# Altium schematic sheet 03_RPiCM4.SchDoc: Raspberry Pi Compute Module 4
size A2; Organization: Greenfield Tech Solutions; Address1: Molendreef 33; Address2: Ossendrecht; Address3: 4641CS; Address4: The Netherlands; SheetNumber: 3; SheetTotal: 11
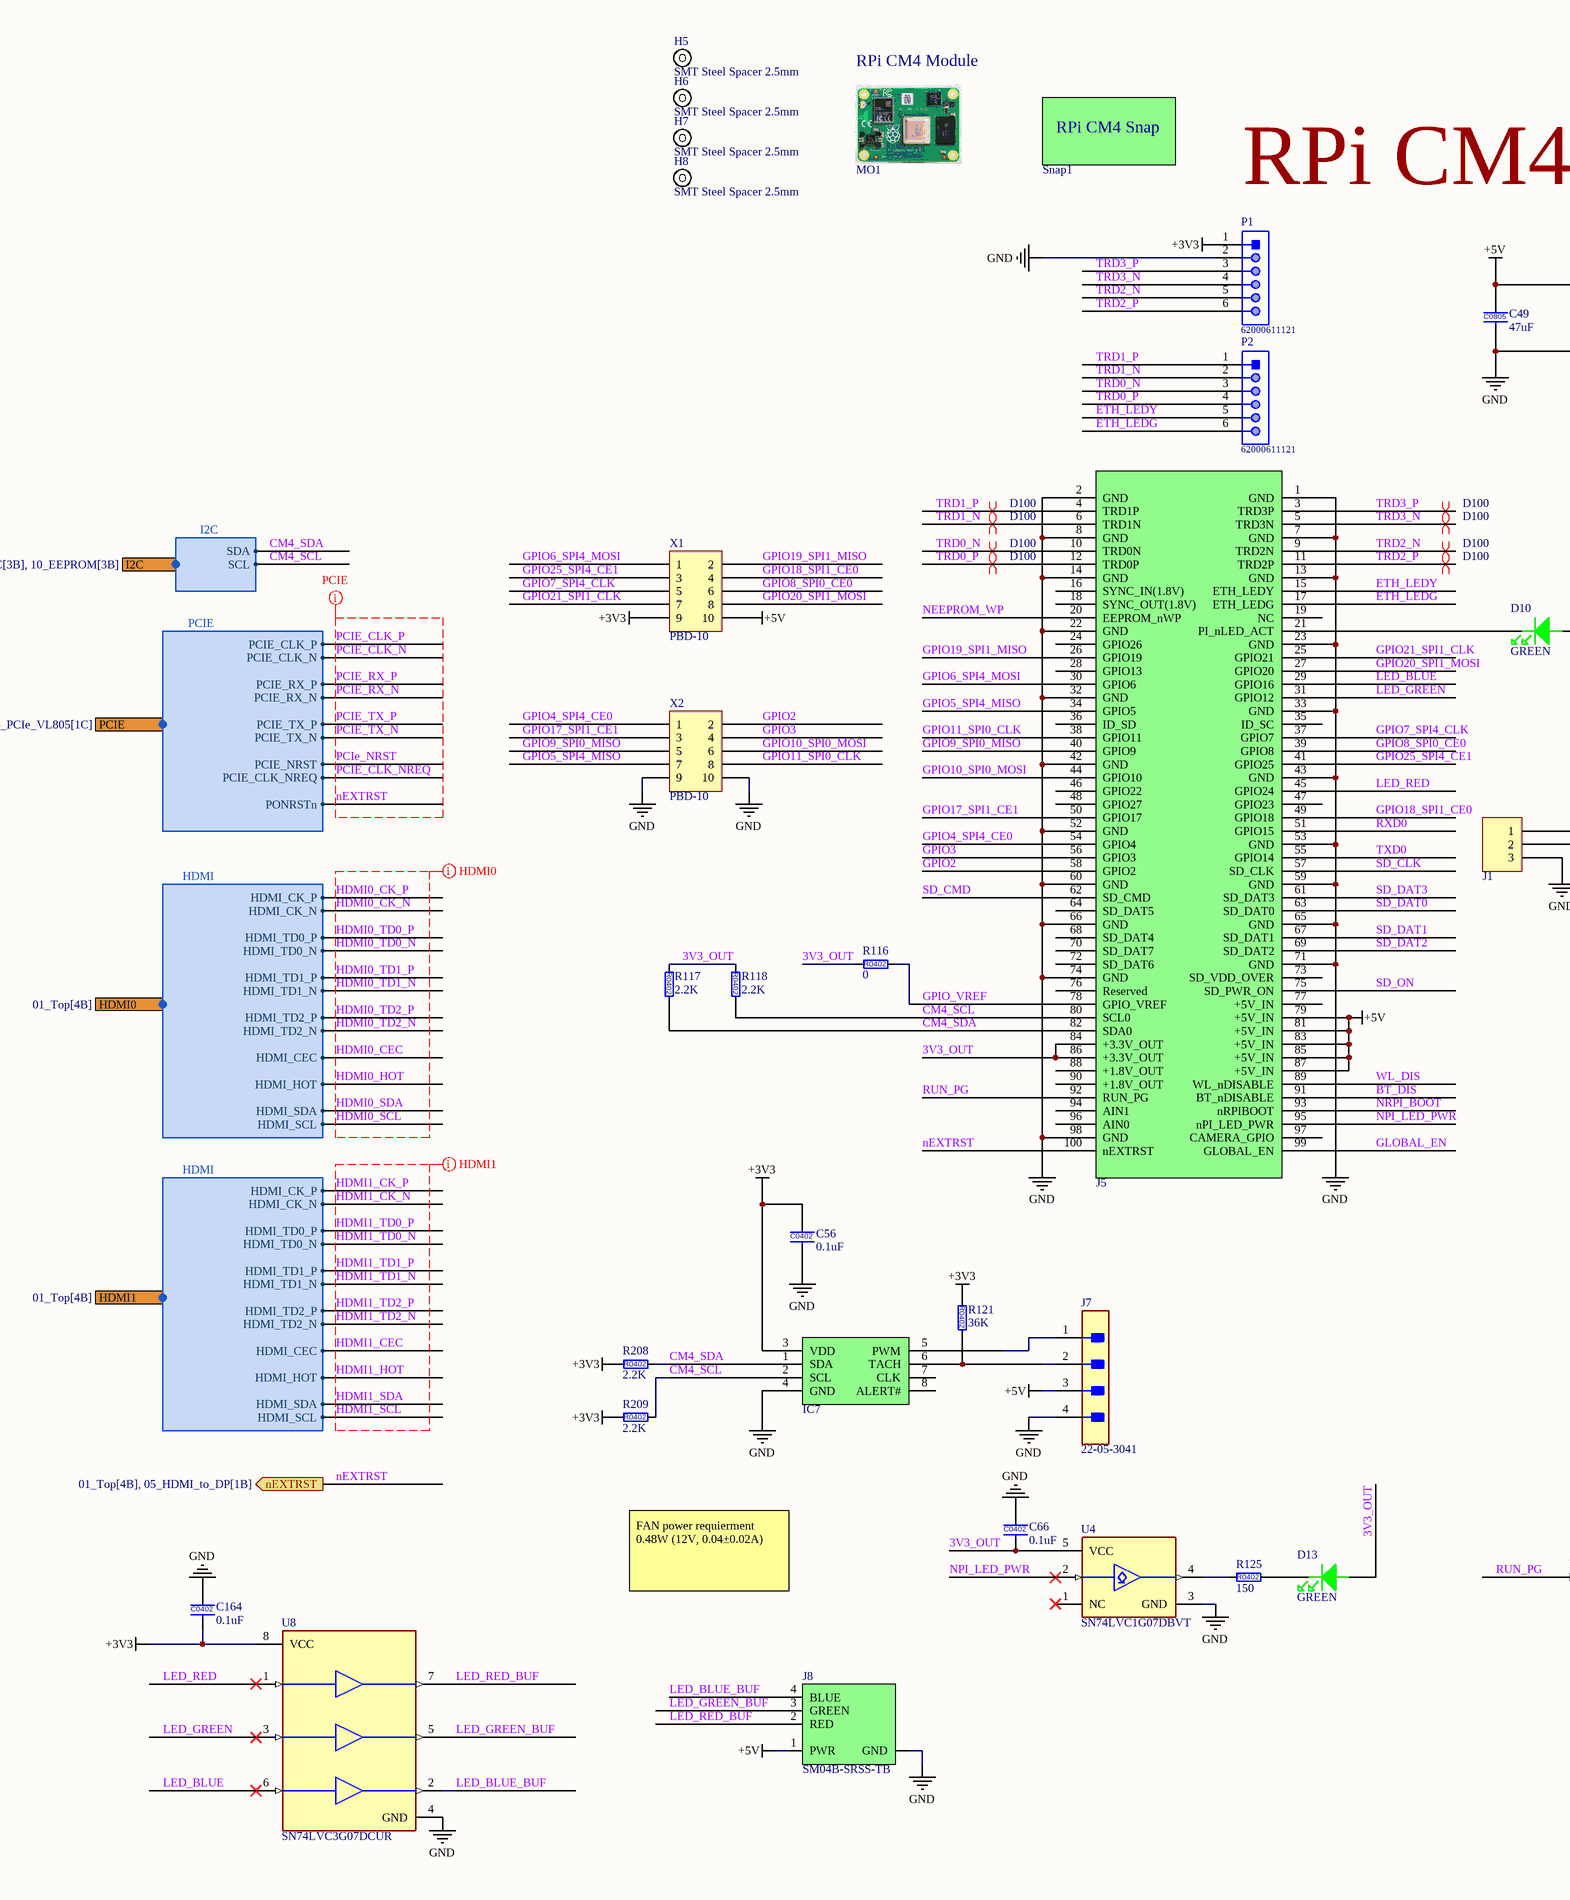
[diagram p0: 03_RPiCM4.SchDoc, left]
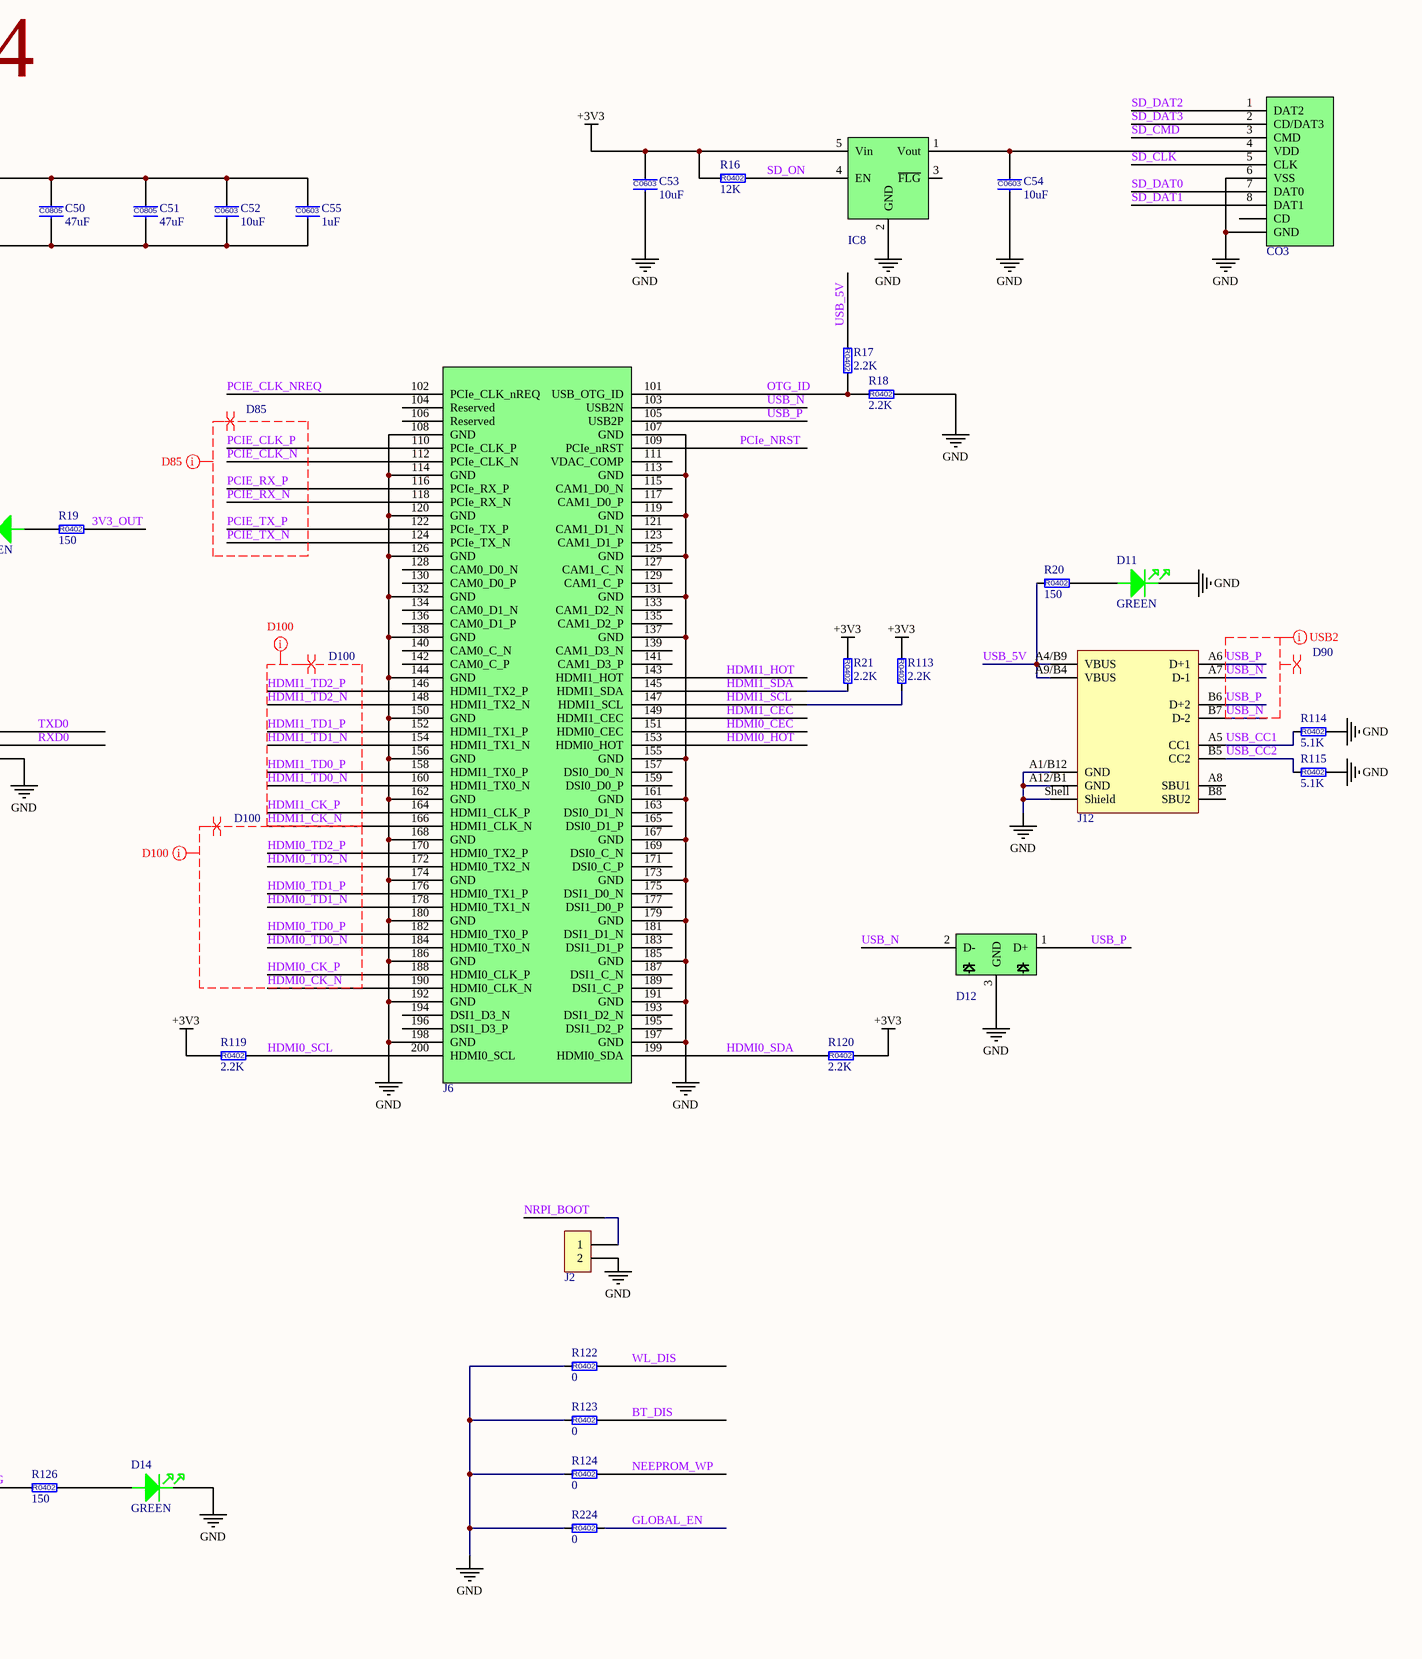
[diagram p1: 03_RPiCM4.SchDoc, right]

## Parts
C49  47uF  [C0805]
C50  47uF  [C0805]
C51  47uF  [C0805]
C52  10uF  [C0603]
C53  10uF  [C0603]
C54  10uF  [C0603]
C55  1uF  [C0603]
C56  0.1uF  [C0402]
C66  0.1uF  [C0402]
C164  0.1uF  [C0402]
CO3  µSD-Card  [693071030811]  (value not drawn)
D10  GREEN  [LED_0603]
D11  GREEN  [LED_0603]
D12  TPD2EUSB30DRTR  [TPD2EUSB30DRTR_SOT-3]  (value not drawn)
D13  GREEN  [LED_0603]
D14  GREEN  [LED_0603]
H5  SMT Steel Spacer 2.5mm  (mechanical)
H6  SMT Steel Spacer 2.5mm  (mechanical)
H7  SMT Steel Spacer 2.5mm  (mechanical)
H8  SMT Steel Spacer 2.5mm  (mechanical)
IC7  EMC2301  [EMC2301-1-ACZL-TR_MSOP-8]  (value not drawn)
IC8  RT9742  [RT9742GGJ5_SOT_23_5]  (value not drawn)
J1  PLS-3  [PLS-3-3D]  (value not drawn)
J2  PLS-2  [PLS-2-3D]  (value not drawn)
J5  CM4-1  [CM4_CON_A]  (value not drawn)
J6  CM4-1  [CM4_Con_B]  (value not drawn)
J7  22-05-3041  [FP-22-05-3041-MFG]
J8  SM04B-SRSS-TB  [SM04B]
J12  USB4105-GF-A  [USB4105-GF-A]  (value not drawn)
MO1  CM4_module  [CM4_step]  (value not drawn)  (no BOM)
P1  62000611121  [62000611121]
P2  62000611121  [62000611121]
R16  12K  [R0402]
R17  2.2K  [R0402]
R18  2.2K  [R0402]
R19  150  [R0402]
R20  150  [R0402]
R21  2.2K  [R0402]
R113  2.2K  [R0402]
R114  5.1K  [R0402]
R115  5.1K  [R0402]
R116  0  [R0402]
R117  2.2K  [R0402]
R118  2.2K  [R0402]
R119  2.2K  [R0402]
R120  2.2K  [R0402]
R121  36K  [R0402]
R122  0  [R0402]
R123  0  [R0402]
R124  0  [R0402]
R125  150  [R0402]
R126  150  [R0402]
R208  2.2K  [R0402]
R209  2.2K  [R0402]
R224  0  [R0402]
Snap1  CM4-1  [CM4_snap]  (value not drawn)  (no BOM)
U4  SN74LVC1G07DBVT  [SN74LVC1G07DBVT_SOT_23_5]
U8  SN74LVC3G07DCUR  [SN74LVC3G07DCUR_VSSOP_8]
X1  PBD-10  [PXD-10]
X2  PBD-10  [PXD-10]

## Ports
HDMI0 (harness HDMI, see 01_Top[4B]), HDMI1 (harness HDMI, see 01_Top[4B]), I2C (harness I2C, see 01_Top[4B], 05_HDMI_to_DP[1B], 06_USB_Type-C_DFP[1B], 07_USB_Type-C_DFP_DP_ALT[1B], 08_USB_Type-C_DFP_DP_ALT_buttom[1B], 09_RTC[3B], 10_EEPROM[3B]), nEXTRST (out, see 01_Top[4B], 05_HDMI_to_DP[1B]), PCIE (harness PCIE, see 01_Top[5B], 04_PCIe_VL805[1C])

## Harnesses
HDMI: HDMI_TD0_P, HDMI_TD1_P, HDMI_TD1_N, HDMI_TD0_N, HDMI_CK_N, HDMI_CK_P, HDMI_TD2_P, HDMI_TD2_N, HDMI_SDA, HDMI_SCL, HDMI_CEC, HDMI_HOT
I2C: SDA, SCL
PCIE: PCIE_CLK_NREQ, PCIE_CLK_P, PCIE_CLK_N, PCIE_NRST, PCIE_RX_P, PCIE_TX_P, PCIE_RX_N, PCIE_TX_N, PONRSTn

## Nets
+3V3: C53.1 C56.1 C164.2 IC7.3(VDD) IC8.5(Vin) P1.1 R16.1 R21.1 R113.1 R119.1 R120.2 R121.1 R208.1 R209.1 U8.8(VCC) X1.9
+5V: C49.1 C50.1 C51.1 C52.1 C55.1 J5.79(+5V_IN) J5.81(+5V_IN) J5.83(+5V_IN) J5.85(+5V_IN) J5.87(+5V_IN) J7.3 J8.1(PWR) X1.10
GND: C49.2 C50.2 C51.2 C52.2 C53.2 C54.2 C55.2 C56.2 C66.1 C164.1 CO3.6(VSS) CO3.GND D11.1(Cathode) D12.3(GND) D14.1(Cathode) IC7.4(GND) IC8.2(GND) J1.3 J2.2 J5.1(GND) J5.2(GND) J5.7(GND) J5.8(GND) J5.13(GND) J5.14(GND) J5.22(GND) J5.23(GND) J5.32(GND) J5.33(GND) J5.42(GND) J5.43(GND) J5.52(GND) J5.53(GND) J5.59(GND) J5.60(GND) J5.65(GND) J5.66(GND) J5.71(GND) J5.74(GND) J5.98(GND) J6.107(GND) J6.108(GND) J6.113(GND) J6.114(GND) J6.119(GND) J6.120(GND) J6.125(GND) J6.126(GND) J6.131(GND) J6.132(GND) J6.137(GND) J6.138(GND) J6.144(GND) J6.150(GND) J6.155(GND) J6.156(GND) J6.161(GND) J6.162(GND) J6.167(GND) J6.168(GND) J6.173(GND) J6.174(GND) J6.179(GND) J6.180(GND) J6.185(GND) J6.186(GND) J6.191(GND) J6.192(GND) J6.197(GND) J6.198(GND) J7.4 J8.5(GND) J12.A1/B12(GND) J12.A12/B1(GND) J12.Shell(Shield) P1.2 R18.2 R114.2 R115.2 R122.1 R123.1 R124.1 R224.1 U4.3(GND) U8.4(GND) X2.9 X2.10
3V3_OUT: C66.2 D13.2(Anode) J5.84(+3.3V_OUT) J5.86(+3.3V_OUT) R19.2 R116.1 R117.1 R118.1 U4.5(VCC)
BT_DIS: J5.91(BT_nDISABLE) R123.2
CM4_SCL: IC7.2(SCL) J5.80(SCL0) R118.2 R209.2 ; port I2C.SCL
CM4_SDA: IC7.1(SDA) J5.82(SDA0) R117.2 R208.2 ; port I2C.SDA
ETH_LEDG: J5.17(ETH_LEDG) P2.6
ETH_LEDY: J5.15(ETH_LEDY) P2.5
GLOBAL_EN: J5.99(GLOBAL_EN) R224.2
GPIO2: J5.58(GPIO2) X2.2
GPIO3: J5.56(GPIO3) X2.4
GPIO4_SPI4_CE0: J5.54(GPIO4) X2.1
GPIO5_SPI4_MISO: J5.34(GPIO5) X2.7
GPIO6_SPI4_MOSI: J5.30(GPIO6) X1.1
GPIO7_SPI4_CLK: J5.37(GPIO7) X1.5
GPIO8_SPI0_CE0: J5.39(GPIO8) X1.6
GPIO9_SPI0_MISO: J5.40(GPIO9) X2.5
GPIO10_SPI0_MOSI: J5.44(GPIO10) X2.6
GPIO11_SPI0_CLK: J5.38(GPIO11) X2.8
GPIO17_SPI1_CE1: J5.50(GPIO17) X2.3
GPIO18_SPI1_CE0: J5.49(GPIO18) X1.4
GPIO19_SPI1_MISO: J5.26(GPIO19) X1.2
GPIO20_SPI1_MOSI: J5.27(GPIO20) X1.8
GPIO21_SPI1_CLK: J5.25(GPIO21) X1.7
GPIO25_SPI4_CE1: J5.41(GPIO25) X1.3
GPIO_VREF: J5.78(GPIO_VREF) R116.2
HDMI0_CEC: J6.151(HDMI0_CEC) ; port HDMI0.HDMI_CEC
HDMI0_CK_N: J6.190(HDMI0_CLK_N) ; port HDMI0.HDMI_CK_N
HDMI0_CK_P: J6.188(HDMI0_CLK_P) ; port HDMI0.HDMI_CK_P
HDMI0_HOT: J6.153(HDMI0_HOT) ; port HDMI0.HDMI_HOT
HDMI0_SCL: J6.200(HDMI0_SCL) R119.2 ; port HDMI0.HDMI_SCL
HDMI0_SDA: J6.199(HDMI0_SDA) R120.1 ; port HDMI0.HDMI_SDA
HDMI0_TD0_N: J6.184(HDMI0_TX0_N) ; port HDMI0.HDMI_TD0_N
HDMI0_TD0_P: J6.182(HDMI0_TX0_P) ; port HDMI0.HDMI_TD0_P
HDMI0_TD1_N: J6.178(HDMI0_TX1_N) ; port HDMI0.HDMI_TD1_N
HDMI0_TD1_P: J6.176(HDMI0_TX1_P) ; port HDMI0.HDMI_TD1_P
HDMI0_TD2_N: J6.172(HDMI0_TX2_N) ; port HDMI0.HDMI_TD2_N
HDMI0_TD2_P: J6.170(HDMI0_TX2_P) ; port HDMI0.HDMI_TD2_P
HDMI1_CEC: J6.149(HDMI1_CEC) ; port HDMI1.HDMI_CEC
HDMI1_CK_N: J6.166(HDMI1_CLK_N) ; port HDMI1.HDMI_CK_N
HDMI1_CK_P: J6.164(HDMI1_CLK_P) ; port HDMI1.HDMI_CK_P
HDMI1_HOT: J6.143(HDMI1_HOT) ; port HDMI1.HDMI_HOT
HDMI1_SCL: J6.147(HDMI1_SCL) R113.2 ; port HDMI1.HDMI_SCL
HDMI1_SDA: J6.145(HDMI1_SDA) R21.2 ; port HDMI1.HDMI_SDA
HDMI1_TD0_N: J6.160(HDMI1_TX0_N) ; port HDMI1.HDMI_TD0_N
HDMI1_TD0_P: J6.158(HDMI1_TX0_P) ; port HDMI1.HDMI_TD0_P
HDMI1_TD1_N: J6.154(HDMI1_TX1_N) ; port HDMI1.HDMI_TD1_N
HDMI1_TD1_P: J6.152(HDMI1_TX1_P) ; port HDMI1.HDMI_TD1_P
HDMI1_TD2_N: J6.148(HDMI1_TX2_N) ; port HDMI1.HDMI_TD2_N
HDMI1_TD2_P: J6.146(HDMI1_TX2_P) ; port HDMI1.HDMI_TD2_P
LED_BLUE: J5.29(GPIO16) U8.6(3A)
LED_BLUE_BUF: J8.4(BLUE) U8.2(3Y)
LED_GREEN: J5.31(GPIO12) U8.3(2A)
LED_GREEN_BUF: J8.3(GREEN) U8.5(2Y)
LED_RED: J5.45(GPIO24) U8.1(1A)
LED_RED_BUF: J8.2(RED) U8.7(1Y)
NEEPROM_WP: J5.20(EEPROM_nWP) R124.2
nEXTRST: J5.100(nEXTRST) ; port nEXTRST, port PCIE.PONRSTn
NPI_LED_PWR: J5.95(nPI_LED_PWR) U4.2(A)
NRPI_BOOT: J2.1 J5.93(nRPIBOOT)
OTG_ID: J6.101(USB_OTG_ID) R17.2 R18.1
PCIE_CLK_N: J6.112(PCIe_CLK_N) ; port PCIE.PCIE_CLK_N
PCIE_CLK_NREQ: J6.102(PCIe_CLK_nREQ) ; port PCIE.PCIE_CLK_NREQ
PCIE_CLK_P: J6.110(PCIe_CLK_P) ; port PCIE.PCIE_CLK_P
PCIe_NRST: J6.109(PCIe_nRST) ; port PCIE.PCIE_NRST
PCIE_RX_N: J6.118(PCIe_RX_N) ; port PCIE.PCIE_RX_N
PCIE_RX_P: J6.116(PCIe_RX_P) ; port PCIE.PCIE_RX_P
PCIE_TX_N: J6.124(PCIe_TX_N) ; port PCIE.PCIE_TX_N
PCIE_TX_P: J6.122(PCIe_TX_P) ; port PCIE.PCIE_TX_P
RUN_PG: J5.92(RUN_PG) R126.1
RXD0: J1.2 J5.51(GPIO15)
SD_CLK: CO3.5(CLK) J5.57(SD_CLK)
SD_CMD: CO3.3(CMD) J5.62(SD_CMD)
SD_DAT0: CO3.7(DAT0) J5.63(SD_DAT0)
SD_DAT1: CO3.8(DAT1) J5.67(SD_DAT1)
SD_DAT2: CO3.1(DAT2) J5.69(SD_DAT2)
SD_DAT3: CO3.2(CD/DAT3) J5.61(SD_DAT3)
SD_ON: IC8.4(EN) J5.75(SD_PWR_ON) R16.2
TRD0_N: J5.10(TRD0N) P2.3
TRD0_P: J5.12(TRD0P) P2.4
TRD1_N: J5.6(TRD1N) P2.2
TRD1_P: J5.4(TRD1P) P2.1
TRD2_N: J5.9(TRD2N) P1.5
TRD2_P: J5.11(TRD2P) P1.6
TRD3_N: J5.5(TRD3N) P1.4
TRD3_P: J5.3(TRD3P) P1.3
TXD0: J1.1 J5.55(GPIO14)
USB_5V: J12.A4/B9(VBUS) J12.A9/B4(VBUS) R17.1 R20.1
USB_CC1: J12.A5(CC1) R114.1
USB_CC2: J12.B5(CC2) R115.1
USB_N: D12.2(D-) J6.103(USB2N) J12.A7(D-1) J12.B7(D-2)
USB_P: D12.1(D+) J6.105(USB2P) J12.A6(D+1) J12.B6(D+2)
WL_DIS: J5.89(WL_nDISABLE) R122.2
NetC54_1: C54.1 CO3.4(VDD) IC8.1(Vout)
NetD10_1: D10.1(Cathode) J5.21(PI_nLED_ACT)
NetD10_2: D10.2(Anode) R19.1
NetD11_2: D11.2(Anode) R20.2
NetD13_1: D13.1(Cathode) R125.2
NetD14_2: D14.2(Anode) R126.2
NetIC7_5: IC7.5(PWM) J7.1
NetIC7_6: IC7.6(TACH) J7.2 R121.2
NetR125_1: R125.1 U4.4(Y)

Not connected (* = marked no-connect by the designer): CO3 CD; IC7 7(CLK) 8(ALERT#); IC8 3(~{FLG}); J5 16(SYNC_IN(1.8V)) 18(SYNC_OUT(1.8V)) 19(NC) 24(GPIO26) 28(GPIO13) 35(ID_SC) 36(ID_SD) 46(GPIO22) 47(GPIO23) 48(GPIO27) 64(SD_DAT5) 68(SD_DAT4) 70(SD_DAT7) 72(SD_DAT6) 73(SD_VDD_OVER) 76(Reserved) 77(+5V_IN) 88(+1.8V_OUT) 90(+1.8V_OUT) 94(AIN1) 96(AIN0) 97(CAMERA_GPIO); J6 104(Reserved) 106(Reserved) 111(VDAC_COMP) 115(CAM1_D0_N) 117(CAM1_D0_P) 121(CAM1_D1_N) 123(CAM1_D1_P) 127(CAM1_C_N) 128(CAM0_D0_N) 129(CAM1_C_P) 130(CAM0_D0_P) 133(CAM1_D2_N) 134(CAM0_D1_N) 135(CAM1_D2_P) 136(CAM0_D1_P) 139(CAM1_D3_N) 140(CAM0_C_N) 141(CAM1_D3_P) 142(CAM0_C_P) 157(DSI0_D0_N) 159(DSI0_D0_P) 163(DSI0_D1_N) 165(DSI0_D1_P) 169(DSI0_C_N) 171(DSI0_C_P) 175(DSI1_D0_N) 177(DSI1_D0_P) 181(DSI1_D1_N) 183(DSI1_D1_P) 187(DSI1_C_N) 189(DSI1_C_P) 193(DSI1_D2_N) 194(DSI1_D3_N) 195(DSI1_D2_P) 196(DSI1_D3_P); J12 A8(SBU1) B8(SBU2); U4 1(NC)*

## Layout directives
net class PCIE: nEXTRST, PCIE_CLK_N, PCIE_CLK_NREQ, PCIE_CLK_P, PCIe_NRST, PCIE_RX_N, PCIE_RX_P, PCIE_TX_N, PCIE_TX_P
net class HDMI0: HDMI0_CEC, HDMI0_CK_N, HDMI0_CK_P, HDMI0_HOT, HDMI0_SCL, HDMI0_SDA, HDMI0_TD0_N, HDMI0_TD0_P, HDMI0_TD1_N, HDMI0_TD1_P, HDMI0_TD2_N, HDMI0_TD2_P
net class D100: HDMI0_CK_N, HDMI0_CK_P, HDMI0_TD0_N, HDMI0_TD0_P, HDMI0_TD1_N, HDMI0_TD1_P, HDMI0_TD2_N, HDMI0_TD2_P, HDMI1_CK_N, HDMI1_CK_P, HDMI1_TD0_N, HDMI1_TD0_P, HDMI1_TD1_N, HDMI1_TD1_P, HDMI1_TD2_N, HDMI1_TD2_P
differential pair; differential pair class D100: HDMI0_CK_N, HDMI0_CK_P, HDMI0_TD0_N, HDMI0_TD0_P, HDMI0_TD1_N, HDMI0_TD1_P, HDMI0_TD2_N, HDMI0_TD2_P, HDMI1_CK_N, HDMI1_CK_P, HDMI1_TD0_N, HDMI1_TD0_P, HDMI1_TD1_N, HDMI1_TD1_P, HDMI1_TD2_N, HDMI1_TD2_P, TRD0_N, TRD0_P, TRD1_N, TRD1_P, TRD2_N, TRD2_P, TRD3_N, TRD3_P
net class HDMI1: HDMI1_CEC, HDMI1_CK_N, HDMI1_CK_P, HDMI1_HOT, HDMI1_SCL, HDMI1_SDA, HDMI1_TD0_N, HDMI1_TD0_P, HDMI1_TD1_N, HDMI1_TD1_P, HDMI1_TD2_N, HDMI1_TD2_P
differential pair; differential pair class D85: PCIE_CLK_N, PCIE_CLK_P, PCIE_RX_N, PCIE_RX_P, PCIE_TX_N, PCIE_TX_P
net class D85: PCIE_CLK_N, PCIE_CLK_P, PCIE_RX_N, PCIE_RX_P, PCIE_TX_N, PCIE_TX_P
net class USB2: USB_N, USB_P
differential pair; differential pair class D90: USB_N, USB_P

## Notes on the sheet
- (near P1) RPi CM4
- FAN power requierment
  0.48W (12V, 0.04±0.02A)
- Title
- Size:
- Date:
- File:
- A2
- Number:
- Time:
- Revision:
- Sheet
- of
- (in symbol 0201ZD105MAT2A) C0603
- (in symbol 0603ZD106KAT2A) C0603
- (in symbol 0805ZD476MAT2A) C0805
- (in symbol 04023D104KAT2A) C0402
- (in symbol CM4_module) RPi CM4 Module
- (in symbol CM4_snap) RPi CM4 Snap
- (in symbol CRCW04022K20FK) R0402
- (in symbol CRCW04025K10FK) R0402
- (in symbol CRCW040212K0FK) R0402
- (in symbol CRCW040236K0FK) R0402
- (in symbol CRCW0402150RFKEDC) R0402
- (in symbol CRCW04020000Z0) R0402

## Library data of the parts
C49-C51 = 0805ZD476MAT2A: CAP CER  47uF 20% 10V X5R 0805; Manufacturer: KYOCERA AVX; Value: 47µF; Manufacturer Part Number: 0805ZD476MAT2A; Tolerance: ±20%; Voltage - Rated: 10V; Temperature Coefficient: X5R
C52-C54 = 0603ZD106KAT2A: CAP CER 10uF 10% 10V X5R 0603; Manufacturer: KYOCERA AVX; Value: 10µF; Manufacturer Part Number: 0603ZD106KAT2A; Tolerance: ±10%; Voltage - Rated: 10V; Temperature Coefficient: X5R
C55 = 0201ZD105MAT2A: CAP CER 1uF 20% 10V X5R 0603; Manufacturer: KYOCERA AVX; Value: 1uF; Tolerance: 20%; Manufacturer Part Number: 0201ZD105MAT2A
C56 C66 C164 = 04023D104KAT2A: CAP CER  0.1uF 10% 25V X5R 0402; Manufacturer: AVX Corporation; Manufacturer Part Number: 04023D104KAT2A; Value: 0.1uF; Voltage - Rated: 25V; Tolerance: ±10%; Temperature Coefficient: X5R
CO3 = 693071030811: Micro Sd Card, Push-Push, 8Pos, Smt Rohs Compliant: Yes; Part Number: CO0027; Manufacturer: Wurth Electronics; ID: 24; Supplier 1: Digi-Key; Manufacturer Part Number: 693071030811; RoHS: No; Stock 1: 3193; Pricing 1: 1=4.01000, 25=3.55000, 100=3.28000, 250=3.01000 (USD); ComponentLink1URL: https://www.we-online.com/catalog/datasheet/693071030811.pdf?src-supplier=Digi-Key; ComponentLink1Description: https://www.we-online.com/catalog/datasheet/693071030811.pdf?src-supplier=Digi-Key; RefVal: µSD-Card; ManfactPart: 693071030811; Supplier Part Number 1: 732-693071030811CT-ND
D10 D11 D13 D14 = LED_SMD_0603_GREEN: LED Uni-Color Yellow Green 574nm 2-Pin Chip 0603(1608Metric) T/R; Manufacturer: Vishay Semiconductors; Manufacturer Part Number: VLMG1300-GS08; Color: Green,Yellow; Forward Voltage: 2V; Forward Current: 20mA; Lens Style: Rectangular,Clear; Luminous Intensity: 35mcd; Number of LEDs: 1; Viewing Angle: 130°; Dominant Wavelength: 571nm; Power Dissipation: 75mW; Reverse Voltage: 5V; Supplier 1: Farnell; RoHS: Yes; Category: LEDs; Stock 1: 18400; Pricing 1: 5=0.31000, 10=0.23700, 100=0.10900, 500=0.09900 (EUR); Mount: Surface Mount; Case/Package: 0603; Number of Pins: 2; Case Code (Metric): 1608; Case Code (Imperial): 0603; Min Operating Temperature: -35°C; Max Operating Temperature: 85°C; Packaging: Tape and Reel; Package Quantity: 1; Series: CHipLED; Illumination Color: Green,Yellow; Wavelength: 571nm; Test Current: 20mA; Number of Elements: 1; Power Rating: 75mW; Length: 1.6mm; Width: 0.8mm; Height: 0.8mm; Depth: 0.8mm; Radiation Hardening: No; RoHS Compliant: Yes; Lead Free: Lead Free; ComponentLink1URL: https://datasheet.ciiva.com/8028/vlmo1300-8028023.pdf?src-supplier=Element14; ComponentLink1Description: https://datasheet.ciiva.com/8028/vlmo1300-8028023.pdf?src-supplier=Element14; ComponentLink2URL: https://datasheet.ciiva.com/2114/vlmo1300-2114971.pdf?src-supplier=Digi-Key; ComponentLink2Description: https://datasheet.ciiva.com/2114/vlmo1300-2114971.pdf?src-supplier=Digi-Key; ComponentLink3URL: https://datasheet.ciiva.com/26322/vlmo1300-26322139.pdf?src-supplier=Element14; ComponentLink3Description: https://datasheet.ciiva.com/26322/vlmo1300-26322139.pdf?src-supplier=Element14; ComponentLink4URL: https://datasheet.ciiva.com/2114/vlmo1300-2114972.pdf?src-supplier=Digi-Key; ComponentLink4Description: https://datasheet.ciiva.com/2114/vlmo1300-2114972.pdf?src-supplier=Digi-Key; ComponentLink5URL: https://datasheet.ciiva.com/26322/vlmo1300-26322140.pdf?src-supplier=Element14; ComponentLink5Description: https://datasheet.ciiva.com/26322/vlmo1300-26322140.pdf?src-supplier=Element14; ComponentLink6URL: https://datasheet.ciiva.com/2114/vlmo1300-2114973.pdf?src-supplier=Digi-Key; ComponentLink6Description: https://datasheet.ciiva.com/2114/vlmo1300-2114973.pdf?src-supplier=Digi-Key; ComponentLink7URL: https://datasheet.ciiva.com/9333/vlmo1300-9333390.pdf?src-supplier=Avnet; ComponentLink7Description: https://datasheet.ciiva.com/9333/vlmo1300-9333390.pdf?src-supplier=Avnet; Supplier Part Number 1: 2251461
D12 = TPD2EUSB30DRTR: Dual 0.7-pF, 5.5-V ±8-kV ESD protection diode with 5-A surge rating for USB 3.0 3-SOT-9X3 -40 to 85; Manufacturer: Texas Instruments; Direction: Bidirectional,Unidirectional; Capacitance: 0.8pF; Number of Bidirectional Channels: 2; Reverse Standoff Voltage: 5.5V; Min Breakdown Voltage: 9V; Clamping Voltage: 8V; Peak Pulse Power: 45W; Power Line Protection: Yes; Test Current: 1mA; Peak Pulse Current: 1A; Supplier 1: Mouser; Manufacturer Part Number: TPD2EUSB30DRTR; RoHS: Yes; Category: Integrated Circuits (ICs); Pricing 1: 1=0.66000, 10=0.56100, 50=0.56000, 100=0.41900, 1000=0.25500, 10000=0.23100 (USD); Case/Package: SOT; Number of Pins: 3; Min Operating Temperature: -40°C; Max Operating Temperature: 85°C; Packaging: Tape and Reel; Package Quantity: 1; Breakdown Voltage: 9V; Number of Channels: 2; Working Voltage: 5.5V; ESD Protection: Yes; Element Configuration: Dual; Interface: USB; Series: -; Number of Unidirectional Channels: 2; Length: 1mm; Width: 0.85mm; Height: 0.45mm; Depth: 0.8mm; Radiation Hardening: No; Reach SVHC Compliant: Yes; Lead Free: Lead Free; RoHS Compliant: Yes; ComponentLink1URL: https://datasheet.ciiva.com/1611/tpd2eusb30-1611602.pdf?src-supplier=Newark; ComponentLink1Description: https://datasheet.ciiva.com/1611/tpd2eusb30-1611602.pdf?src-supplier=Newark; ComponentLink2URL: https://datasheet.ciiva.com/15134/getdatasheetpartid-202713-15134479.pdf?src-supplier=Verical; ComponentLink2Description: https://datasheet.ciiva.com/15134/getdatasheetpartid-202713-15134479.pdf?src-supplier=Verical; ComponentLink3URL: https://datasheet.ciiva.com/1504/1882087-1504248.pdf?src-supplier=Element14; ComponentLink3Description: https://datasheet.ciiva.com/1504/1882087-1504248.pdf?src-supplier=Element14; ComponentLink4URL: https://datasheet.ciiva.com/353/tpd2eusb30-353273.pdf?src-supplier=Digi-Key; ComponentLink4Description: https://datasheet.ciiva.com/353/tpd2eusb30-353273.pdf?src-supplier=Digi-Key; ComponentLink5URL: https://datasheet.ciiva.com/353/tpd2eusb30-353272.pdf?src-supplier=Digi-Key; ComponentLink5Description: https://datasheet.ciiva.com/353/tpd2eusb30-353272.pdf?src-supplier=Digi-Key; ComponentLink6URL: https://datasheet.ciiva.com/353/tpd2eusb30-353274.pdf?src-supplier=Digi-Key; ComponentLink6Description: https://datasheet.ciiva.com/353/tpd2eusb30-353274.pdf?src-supplier=Digi-Key; Supplier Part Number 1: 595-TPD2EUSB30DRTR
H5-H8 = 9774030151R: Spacer Material: Steel Mounting: SMT Series: WA-SMSI Thread D: M2.5; Manufacturer: Wurth Electronics; AN: 22898; Mixed: THT; Plating: Tin; Threaded/Unthreaded: Threaded; Outside Diameter: 0.201inch; Supplier 1: Digi-Key; Manufacturer Part Number: 9774030151R; RoHS: Yes; Category: Spacers, Standoffs; Stock 1: 88000; Pricing 1: 1=1.01000, 10=0.97900, 50=0.84800, 100=0.78800 (USD); Material: Steel; Series: WA-SMSI; Length: 0.173inch; ComponentLink1URL: http://www.farnell.com/datasheets/1960367.pdf?src-supplier=Farnell; ComponentLink1Description: http://www.farnell.com/datasheets/1960367.pdf?src-supplier=Farnell; ComponentLink2URL: http://www.mouser.com/ds/2/445/9774030151R-611445.pdf?src-supplier=Mouser; ComponentLink2Description: http://www.mouser.com/ds/2/445/9774030151R-611445.pdf?src-supplier=Mouser; ComponentLink3URL: https://media.digikey.com/pdf/Data%20Sheets/Wurth%20Electronics%20PDFs/WA-SMSx_Performance_Flyer.pdf?src-supplier=Digi-Key; ComponentLink3Description: https://media.digikey.com/pdf/Data%20Sheets/Wurth%20Electronics%20PDFs/WA-SMSx_Performance_Flyer.pdf?src-supplier=Digi-Key; ComponentLink4URL: http://www.farnell.com/datasheets/1960367.pdf?src-supplier=Element14; ComponentLink4Description: http://www.farnell.com/datasheets/1960367.pdf?src-supplier=Element14; ComponentLink5URL: http://www.farnell.com/datasheets/1960367.pdf?src-supplier=Newark; ComponentLink5Description: http://www.farnell.com/datasheets/1960367.pdf?src-supplier=Newark; Supplier Part Number 1: 732-7083-1-ND
IC7 = EMC2301-1-ACZL-TR: RPM-BASED PWM FAN CONTROLLER; Part Number: IC0054; Manufacturer: Microchip; ID: 54; Operating Supply Voltage: 3.3V; Min Supply Voltage: 3V; Max Supply Voltage: 3.6V; Interface: PWM,I2C,SMBus,2-Wire; Operating Supply Current: 350uA; Output Type: Digital; ManfactPart: EMC2301-1-ACZL-TR; Supplier 1: Digi-Key; Manufacturer Part Number: EMC2301-1-ACZL-TR; RoHS: Yes; Category: Motor Drivers; Stock 1: 7394; Pricing 1: 1=1.24000, 25=1.12480 (USD); Mount: Surface Mount; Case/Package: MSOP; Number of Pins: 8; Min Operating Temperature: -40°C; Max Operating Temperature: 125°C; Package Quantity: 1; Packaging: Tape and Reel; Max Supply Voltage (DC): 3.6V; Min Supply Voltage (DC): 3V; Series: -; Lead Free: Lead Free; ComponentLink1URL: https://datasheet.ciiva.com/29573/2301-29573777.pdf?src-supplier=Digi-Key; ComponentLink1Description: https://datasheet.ciiva.com/29573/2301-29573777.pdf?src-supplier=Digi-Key; ComponentLink2URL: https://datasheet.ciiva.com/48437/2301-48437622.pdf?src-supplier=Avnet; ComponentLink2Description: https://datasheet.ciiva.com/48437/2301-48437622.pdf?src-supplier=Avnet; ComponentLink3URL: https://datasheet.ciiva.com/6607/2301-6607817.pdf?src-supplier=Digi-Key; ComponentLink3Description: https://datasheet.ciiva.com/6607/2301-6607817.pdf?src-supplier=Digi-Key; Supplier Part Number 1: EMC2301-1-ACZL-CT-ND; RefVal: EMC2301
IC8 = RT9742GGJ5: IC Pwr Swtch N-chan 1: 1 TSOT23-5; Part Number: IC0029; Manufacturer: Richtek; ID: 29; Number of Outputs: 1; Interface: On/Off; Max Output Current: 1A; Fault Protection: Over Temperature,Reverse Current; Output Configuration: High Side; On-State Resistance: 70mR; ManfactPart: RT9742GGJ5; Supplier 1: Digi-Key; Manufacturer Part Number: RT9742GGJ5; RoHS: Yes; Category: Power Management ICs; Stock 1: 8743; Pricing 1: 1=4.03000, 10=3.62300, 25=3.42480, 100=2.96820, 250=2.81600, 500=2.52678, 1000=2.15400 (USD); Case/Package: SOT-23-5; Number of Pins: 23; Min Operating Temperature: -40°C; Max Operating Temperature: 85°C; Packaging: Cut Tape; Series: -; RoHS Compliant: Yes; Reach SVHC Compliant: Yes; ComponentLink1URL: http://www.farnell.com/datasheets/2045592.pdf?src-supplier=Farnell; ComponentLink1Description: http://www.farnell.com/datasheets/2045592.pdf?src-supplier=Farnell; ComponentLink2URL: http://www.richtek.com/assets/product_file/RT9742/DS9742-03.pdf?src-supplier=Digi-Key; ComponentLink2Description: http://www.richtek.com/assets/product_file/RT9742/DS9742-03.pdf?src-supplier=Digi-Key; ComponentLink3URL: http://www.farnell.com/datasheets/2045592.pdf?src-supplier=Element14; ComponentLink3Description: http://www.farnell.com/datasheets/2045592.pdf?src-supplier=Element14; RefVal: RT9742; Supplier Part Number 1: 1028-1436-1-ND
J1 = PLS-3: Board to Board Connector Straight Header Single Row 3 Position 2.54mm Pitch Through Hole Bag; Manufacturer: Amphenol; Manufacturer Part Number: G800W305018EU; Supplier 1: Mouser; RoHS: Yes; Category: Connectors; Stock 1: 26660; Pricing 1: 1=0.10000, 10=0.04200, 50=0.04200, 100=0.04000, 1000=0.03500, 10000=0.03000 (USD); Supplier Part Number 1: 523-G800W305018EU
J2 = PLS-2: Pin Header 2.54MM Pitch Str, 1X2PIN, Full G/f, NY6T, 6.1MM*2.5MM*3.0MM / Bag; Manufacturer: Amphenol; Manufacturer Part Number: G800W306018EU; Supplier 1: Mouser; RoHS: Yes; Category: Connectors; Stock 1: 26660; Pricing 1: 1=0.10000, 10=0.04200, 50=0.04200, 100=0.04000, 1000=0.03500, 10000=0.03000 (USD); Supplier Part Number 1: 523-G800W305018EU; Supplier 2: Mouser; Stock 2: 25697; Pricing 2: 1=0.10000, 10=0.03000, 50=0.03000, 100=0.02900, 1000=0.02600, 10000=0.02100 (USD); Supplier Part Number 2: 523-G800W306018EU
J5 = CM4_module_A: 0.4mm Pitch, 1.5-4.0mm Height, Board to Board / FPC to Board Connectors; Part Number: MO0012; ManfactPart: DF40HC(3.0)-100DS-0.4V; Manufacturer: Hirose; Manufacturer Part Number: DF40HC(3.0)-100DS-0.4V(51; ID: 12; RefVal: CM4-1; Supplier 1: Mouser; RoHS: Yes; Category: Headers and Wire Housings; Stock 1: 26786; Pricing 1: 1=2.70000, 10=2.32000, 50=2.32000, 100=2.16000, 1000=1.57000, 10000=1.45000 (USD); ComponentLink1URL: https://datasheet.ciiva.com/13559/ed-df40-20140305-13559540.pdf?src-supplier=Mouser; ComponentLink1Description: https://datasheet.ciiva.com/13559/ed-df40-20140305-13559540.pdf?src-supplier=Mouser; ComponentLink2URL: https://datasheet.ciiva.com/18562/ed-df40-20140305-18562462.pdf?src-supplier=Digi-Key; ComponentLink2Description: https://datasheet.ciiva.com/18562/ed-df40-20140305-18562462.pdf?src-supplier=Digi-Key; Supplier Part Number 1: 798-DF40HC30100DS451
J6 = CM4_module_B: 0.4mm Pitch, 1.5-4.0mm Height, Board to Board / FPC to Board Connectors; Part Number: MO0012; ManfactPart: DF40HC(3.0)-100DS-0.4V; Manufacturer: Hirose; Manufacturer Part Number: DF40HC(3.0)-100DS-0.4V(51; ID: 12; RefVal: CM4-1; Supplier 1: Mouser; RoHS: Yes; Category: Headers and Wire Housings; Stock 1: 26786; Pricing 1: 1=2.70000, 10=2.32000, 50=2.32000, 100=2.16000, 1000=1.57000, 10000=1.45000 (USD); ComponentLink1URL: https://datasheet.ciiva.com/13559/ed-df40-20140305-13559540.pdf?src-supplier=Mouser; ComponentLink1Description: https://datasheet.ciiva.com/13559/ed-df40-20140305-13559540.pdf?src-supplier=Mouser; ComponentLink2URL: https://datasheet.ciiva.com/18562/ed-df40-20140305-18562462.pdf?src-supplier=Digi-Key; ComponentLink2Description: https://datasheet.ciiva.com/18562/ed-df40-20140305-18562462.pdf?src-supplier=Digi-Key; Supplier Part Number 1: 798-DF40HC30100DS451
J7 = 22-05-3041: KK 254 Solid Header, Right-Angle, with Friction Lock, 4 Circuits, Tin (Sn) Plating; Manufacturer: Molex; Current Rating: 4A; Conn Gender: Male; Number Of Contacts: 4; Conn Orientation: Right Angle; Voltage Rating: 500V; Pitch: 2.54mm; Contact Resistance: 10mR; Voltage Rating (DC): 250V; Insulation Resistance: 50GR; Approvals: UL,CSA; Glow Wire Compliant: Non-compliant; Number Of Rows: 1; Contact Material: Tin,Nickel; Temperature Range Low: -40°C; ComponentLink2Description: Datasheet; Automotive: No; Lead Free: Yes; ComponentLink2URL: https://www.molex.com/webdocs/datasheets/pdf/en-us/0022053041_PCB_HEADERS.pdf; Octopart: https://octopart.com/22-05-3041-molex-2579; Temperature: -40°C to +80°C; Height: 6.6mm; Device Class L3: unset; Temperature Range High: +80°C; Manufacturer Part Number: 22-05-3041; Device Class L2: Headers and Wire Housings; RoHS: TRUE; Footprint Url: https://www.molex.com/pdm_docs/sd/022053041_sd.pdf; Category: Conn; Digikey Description: CONN HEADER R/A 4POS 2.54MM; Device Class L1: Connectors; Package: 0; Supplier 1: Digi-Key; Stock 1: 91858; Pricing 1: 1=0.69000, 10=0.57900, 100=0.45030, 1000=0.35380, 5000=0.31091, 10000=0.28947 (USD); Mounting Technology: Through Hole; Color: White; Housing Color: White; Housing Material: Nylon; Contact Plating: Tin,Copper; Min Operating Temperature: 0°C; Max Operating Temperature: 75°C; Packaging: Bulk; Number of Positions: 4; Termination: Solder; Orientation: Right Angle; Series: KK® 7478; Gender: Male; Contact Type: Male Pin; Fastening Type: Friction; Max Current Rating: 4A; Package Quantity: 12000; Number of Circuits: 4; Contact Gender: Male; Length: 10.16mm; Depth: 12.83mm; Contact Mating Length: 0.264inch; Radiation Hardening: No; RoHS Compliant: Yes; Flammability Rating: UL94 V-0; Halogen Free: Low Halogen; Supplier Part Number 1: WM4302-ND
J8 = SM04B-SRSS-TB: CONN HEADER SH 4POS SIDE 1MM TIN; Part Number: CO0056; Manufacturer: JST; Manufacturer Part Number: SM04B-SRSS-TB(LF)(SN); ID: 56; RefVal: Led Connector; ManfactPart: SM04B-SRSS-TB; Supplier 1: Digi-Key; RoHS: Yes; Category: Connectors; Stock 1: 43305; Pricing 1: 1=0.57000, 10=0.49300, 100=0.40630, 500=0.35328, 1000=0.29146 (USD); ComponentLink1URL: https://datasheet.ciiva.com/26894/getdatasheetpartid-640736-26894676.pdf?src-supplier=Verical; ComponentLink1Description: https://datasheet.ciiva.com/26894/getdatasheetpartid-640736-26894676.pdf?src-supplier=Verical; ComponentLink2URL: https://datasheet.ciiva.com/26894/getdatasheetpartid-499363-26894945.pdf?src-supplier=Verical; ComponentLink2Description: https://datasheet.ciiva.com/26894/getdatasheetpartid-499363-26894945.pdf?src-supplier=Verical; ComponentLink3URL: https://datasheet.ciiva.com/16487/jstsm04b-srss-tb-lf-sn-16487222.pdf?src-supplier=Future+Electronics; ComponentLink3Description: https://datasheet.ciiva.com/16487/jstsm04b-srss-tb-lf-sn-16487222.pdf?src-supplier=Future+Electronics; Supplier Part Number 1: 455-1804-1-ND
J12 = USB4105-GF-A: Conn USB 2.0 Type C RCP 24 POS 0.3mm/0.5mm Solder RA SMD 24 Terminal 1 Port T/R; Manufacturer: Global Connector Technology; Gender: Receptacle; Mating Cycles: 10000; Shielding: Shielded; Number of Ports: 1; Supplier 1: Farnell; Manufacturer Part Number: USB4105-GF-A; RoHS: No; Category: USB Connectors; Stock 1: 800; Pricing 1: 800=0.44400, 4000=0.40300, 8000=0.38200, 16000=0.36900 (EUR); Mounting Technology: Surface Mount,Through Hole,Horizontal; Contact Plating: Gold; Insulation Color: Black; Min Operating Temperature: -40°C; Max Operating Temperature: 85°C; Connector Type: USB; Series: USB4105; Termination: Solder; Flammability Rating: UL94 V-0; ComponentLink1URL: https://gct.co/files/drawings/usb4105.pdf?src-supplier=Digi-Key; ComponentLink1Description: https://gct.co/files/drawings/usb4105.pdf?src-supplier=Digi-Key; Supplier Part Number 1: 3588199
MO1 = CM4_module: CM4 module; Part Number: MO0011; ManfactPart: RPI CM4; ID: 11; RefVal: CM4
P1 P2 = CMP-1502-00960-1: THT Vertical Pin Header WR-PHD, Pitch 2.00 mm, Single Row, 6 pins; Manufacturer: Wurth Elektronik; Rated Current: 2A; Pitch: 2.00mm; Working Voltage: 200VAC; Withstanding Voltage: 500VAC; Contact Resistance: 20mOhm; Pin Number: 6; Gender: Male; Package Reference: 62000611121; Part Number: 62000611121; Manufacturer URL: http://www.we-online.de; Row Number: Single; Datasheet URL: https://katalog.we-online.de/em/datasheet/62000611121.pdf; Orientation: Vertical; Operating Temperature: -40to105degC; Packaging: Bag; Publisher: WurthElektronik; Mounting Technology: THT
R16 = CRCW040212K0FK: RES SMD 12K ohm 1% 1/16W R0402; Manufacturer: Vishay; check: ok; Manufacturer Part Number: CRCW040212K0FK; Value: 12K; Power (Watts): 1/16W; Package / Case: 0402; Tolerance: ±1%
R17 R18 R21 R113 R117-R120 R208 R209 = CRCW04022K20FK: RES SMD 2.2K ohm 1% 1/16W R0402; Manufacturer: Vishay; check: ok; Manufacturer Part Number: CRCW04022K20FK; Value: 2.2K; Power (Watts): 1/16W; Package / Case: 0402; Tolerance: ±1%
R19 R20 R125 R126 = CRCW0402150RFKEDC: RES SMD 150 ohm 1% 1/16W R0402; Manufacturer: Vishay Dale; check: ok; Manufacturer Part Number: CRCW0402150RFKEDC; Value: 150; Power (Watts): 1/16W; Package / Case: 0402; Tolerance: ±1%
R114 R115 = CRCW04025K10FK: RES SMD 5.1K ohm 1% 1/16W R0402; Manufacturer: Vishay; check: ok; Manufacturer Part Number: CRCW04025K10FK; Value: 5.1K; Power (Watts): 1/16W; Package / Case: 0805 (2012 Metric); Tolerance: ±1%
R116 R122-R124 R224 = CRCW04020000Z0: RES SMD 0 ohm 1/16W R0402; Manufacturer: Vishay Dale; check: ok; Manufacturer Part Number: CRCW04020000Z0; Value: 0; Power (Watts): 1/16W; Package / Case: 0402
R121 = CRCW040236K0FK: RES SMD 36K ohm 1% 1/16W R0402; Manufacturer: Vishay; check: ok; Manufacturer Part Number: CRCW040236K0FK; Value: 36K; Power (Watts): 1/16W; Package / Case: 0402; Tolerance: ±1%
Snap1 = CM4_snap: RPI CM4 snap; Part Number: MO0012; ID: 12; RefVal: CM4-1
U4 = SN74LVC1G07DBVT: Single 1.65-V to 5.5-V buffer with open-drain outputs 5-SOT-23 -40 to 125; Manufacturer: Texas Instruments; Number Of Inputs: 1; Min Supply Voltage: 1.65V; Propagation Delay: 4ns; Max Supply Voltage: 5.5V; Max Junction Temp: +150°C; Standoff Height: 0mm; Nominal Supply Current: 10uA; Logic Function Desc: Non-Inverting; Logic Function: Buffer,Inverting; Low Level Output Current: 32mA; Turn-On Delay Time: 8.3ns; ComponentLink2URL: http://www.ti.com/lit/ds/symlink/sn74lvc1g07.pdf; Temperature: -40°C to +125°C; Package: DBV0005A; Temperature Range High: +125°C; Number Of Circuits: 1; Manufacturer Part Number: SN74LVC1G07DBVT; Height: 1.45mm; Automotive: No; Ambient Temperature Range High: +125°C; Device Class L2: Logic ICs; RoHS: TRUE; Device Class L1: Integrated Circuits (ICs); Mouser Description: Buffers & Line Drivers SNGL Buffer/Driver; Lead Free: Yes; Temperature Range Low: -40°C; Digikey Description: IC BUF NON-INVERT 5.5V SOT23-5; Number Of Outputs: 1; Octopart: https://octopart.com/sn74lvc1g07dbvt-texas+instruments-1006798; Ambient Temperature Range Low: -40°C; ComponentLink2Description: Datasheet; Device Class L3: Buffers; Category: IC; Supplier 1: Arrow Electronics; Stock 1: 234; Pricing 1: 1=0.92900, 10=0.83040, 25=0.79550, 100=0.65680 (USD); Mount: Surface Mount; Case/Package: SOT-23; Number of Pins: 5; Min Operating Temperature: -40°C; Max Operating Temperature: 125°C; Packaging: Tape and Reel; Number of Channels: 1; Package Quantity: 1; Number of Elements: 1; Number of Bits per Element: 1; Number of Input Lines: 1; Number of Output Lines: 1; Polarity: Non-Inverting; Quiescent Current: 10uA; Number of Gates: 1; Number of Bits: 1; Series: 74LVC; Technology: CMOS; Termination: SMD/SMT; Length: 2.9mm; Width: 1.6mm; Radiation Hardening: No; RoHS Compliant: Yes; Reach SVHC Compliant: Yes; ComponentLink1URL: https://datasheet.ciiva.com/15094/getdatasheetpartid-82831-15094598.pdf?src-supplier=Verical; ComponentLink1Description: https://datasheet.ciiva.com/15094/getdatasheetpartid-82831-15094598.pdf?src-supplier=Verical; ComponentLink3URL: https://datasheet.ciiva.com/41456/001017126-da-01-en-ic-b-dvr-sn74-sn74lvc1g07dbvt-sot-5-tid-41456046.pdf?src-supplier=Conrad; ComponentLink3Description: https://datasheet.ciiva.com/41456/001017126-da-01-en-ic-b-dvr-sn74-sn74lvc1g07dbvt-sot-5-tid-41456046.pdf?src-supplier=Conrad; ComponentLink4URL: https://datasheet.ciiva.com/1841/sn74lvc1g07-1841399.pdf?src-supplier=Digi-Key; ComponentLink4Description: https://datasheet.ciiva.com/1841/sn74lvc1g07-1841399.pdf?src-supplier=Digi-Key; ComponentLink5URL: https://datasheet.ciiva.com/1841/sn74lvc1g07-1841398.pdf?src-supplier=Digi-Key; ComponentLink5Description: https://datasheet.ciiva.com/1841/sn74lvc1g07-1841398.pdf?src-supplier=Digi-Key; ComponentLink6URL: https://datasheet.ciiva.com/1841/sn74lvc1g07-1841400.pdf?src-supplier=Digi-Key; ComponentLink6Description: https://datasheet.ciiva.com/1841/sn74lvc1g07-1841400.pdf?src-supplier=Digi-Key; Supplier Part Number 1: SN74LVC1G07DBVT
U8 = SN74LVC3G07DCUR: Buffer/Driver 3-CH Non-Inverting Open Drain CMOS 8-Pin VSSOP T/R; Manufacturer: Texas Instruments; Number of Elements: 3; Max Supply Voltage: 5.5V; Min Supply Voltage: 1.65V; Propagation Delay: 2.9ns; Logic Function: Buffer,Inverting; Number of Bits per Element: 1; Low Level Output Current: 32mA; Turn-On Delay Time: 7.8ns; Quiescent Current: 10uA; Supplier 1: Digi-Key; Manufacturer Part Number: SN74LVC3G07DCUR; RoHS: Yes; Category: Buffers, Drivers and Transceivers; Stock 1: 5211; Pricing 1: 1=0.64000, 10=0.54500, 25=0.50880, 100=0.40700, 250=0.37796, 500=0.31982, 1000=0.24713 (USD); Mounting Technology: Surface Mount; Case/Package: VSSOP; Pins: 8; Min Operating Temperature: -40°C; Max Operating Temperature: 125°C; Packaging: Tape and Reel; Package Quantity: 3000; Number of Channels: 3; Number of Inputs: 3; Number of Outputs: 3; Number of Input Lines: 3; Number of Output Lines: 3; Polarity: Non-Inverting; Number of Gates: 3; Series: 74LVC; Technology: CMOS; Number of Bits: 3; High Level Output Current: 32mA; Radiation Hardening: No; Lead Free: Lead Free; RoHS Compliant: Yes; Reach SVHC Compliant: Yes; ComponentLink1URL: https://datasheet.ciiva.com/1834/sn74lvc3g07-1834416.pdf?src-supplier=Digi-Key; ComponentLink1Description: https://datasheet.ciiva.com/1834/sn74lvc3g07-1834416.pdf?src-supplier=Digi-Key; ComponentLink2URL: https://datasheet.ciiva.com/15095/getdatasheetpartid-196852-15095028.pdf?src-supplier=Verical; ComponentLink2Description: https://datasheet.ciiva.com/15095/getdatasheetpartid-196852-15095028.pdf?src-supplier=Verical; ComponentLink3URL: https://datasheet.ciiva.com/46386/1847468-46386028.pdf?src-supplier=Element14; ComponentLink3Description: https://datasheet.ciiva.com/46386/1847468-46386028.pdf?src-supplier=Element14; ComponentLink4URL: https://datasheet.ciiva.com/1834/sn74lvc3g07-1834415.pdf?src-supplier=Digi-Key; ComponentLink4Description: https://datasheet.ciiva.com/1834/sn74lvc3g07-1834415.pdf?src-supplier=Digi-Key; ComponentLink5URL: https://datasheet.ciiva.com/1834/sn74lvc3g07-1834417.pdf?src-supplier=Digi-Key; ComponentLink5Description: https://datasheet.ciiva.com/1834/sn74lvc3g07-1834417.pdf?src-supplier=Digi-Key; ComponentLink6URL: https://datasheet.ciiva.com/48703/001074022-da-01-en-ic-buff-dvr-trp-sn74lvc3g07dcur-us-8-tid-48703403.pdf?src-supplier=Conrad; ComponentLink6Description: https://datasheet.ciiva.com/48703/001074022-da-01-en-ic-buff-dvr-trp-sn74lvc3g07dcur-us-8-tid-48703403.pdf?src-supplier=Conrad; Supplier Part Number 1: 296-13283-1-ND
X1 X2 = PBD-10: Header, 5-Pin, Dual row